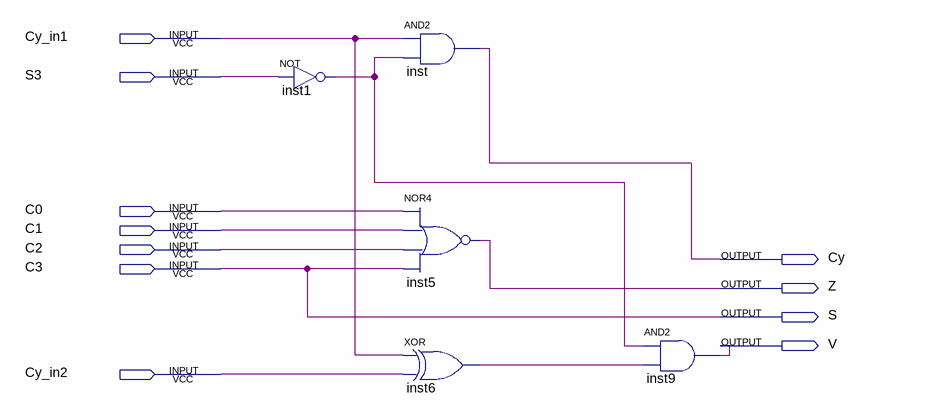
[diagram p0: schematic sheet]
// Quartus schematic state4bits.bdf as structural Verilog: 5 symbols, 11 pins
module state4bits (
  input  Cy_in1,
  input  S3,
  input  C0,
  input  C1,
  input  C2,
  input  C3,
  input  Cy_in2,
  output Cy,
  output Z,
  output S,
  output V
);

  wire inst1_out, inst6_out;

  not inst1 (inst1_out, S3);
  and inst (Cy, Cy_in1, inst1_out);
  nor inst5 (Z, C0, C1, C2, C3);
  xor inst6 (inst6_out, Cy_in1, Cy_in2);
  and inst9 (V, inst1_out, inst6_out);

  assign S = C3;
endmodule
